# EAGLE design BlindsControl (EAGLE 7.5.0)
Blinds Control
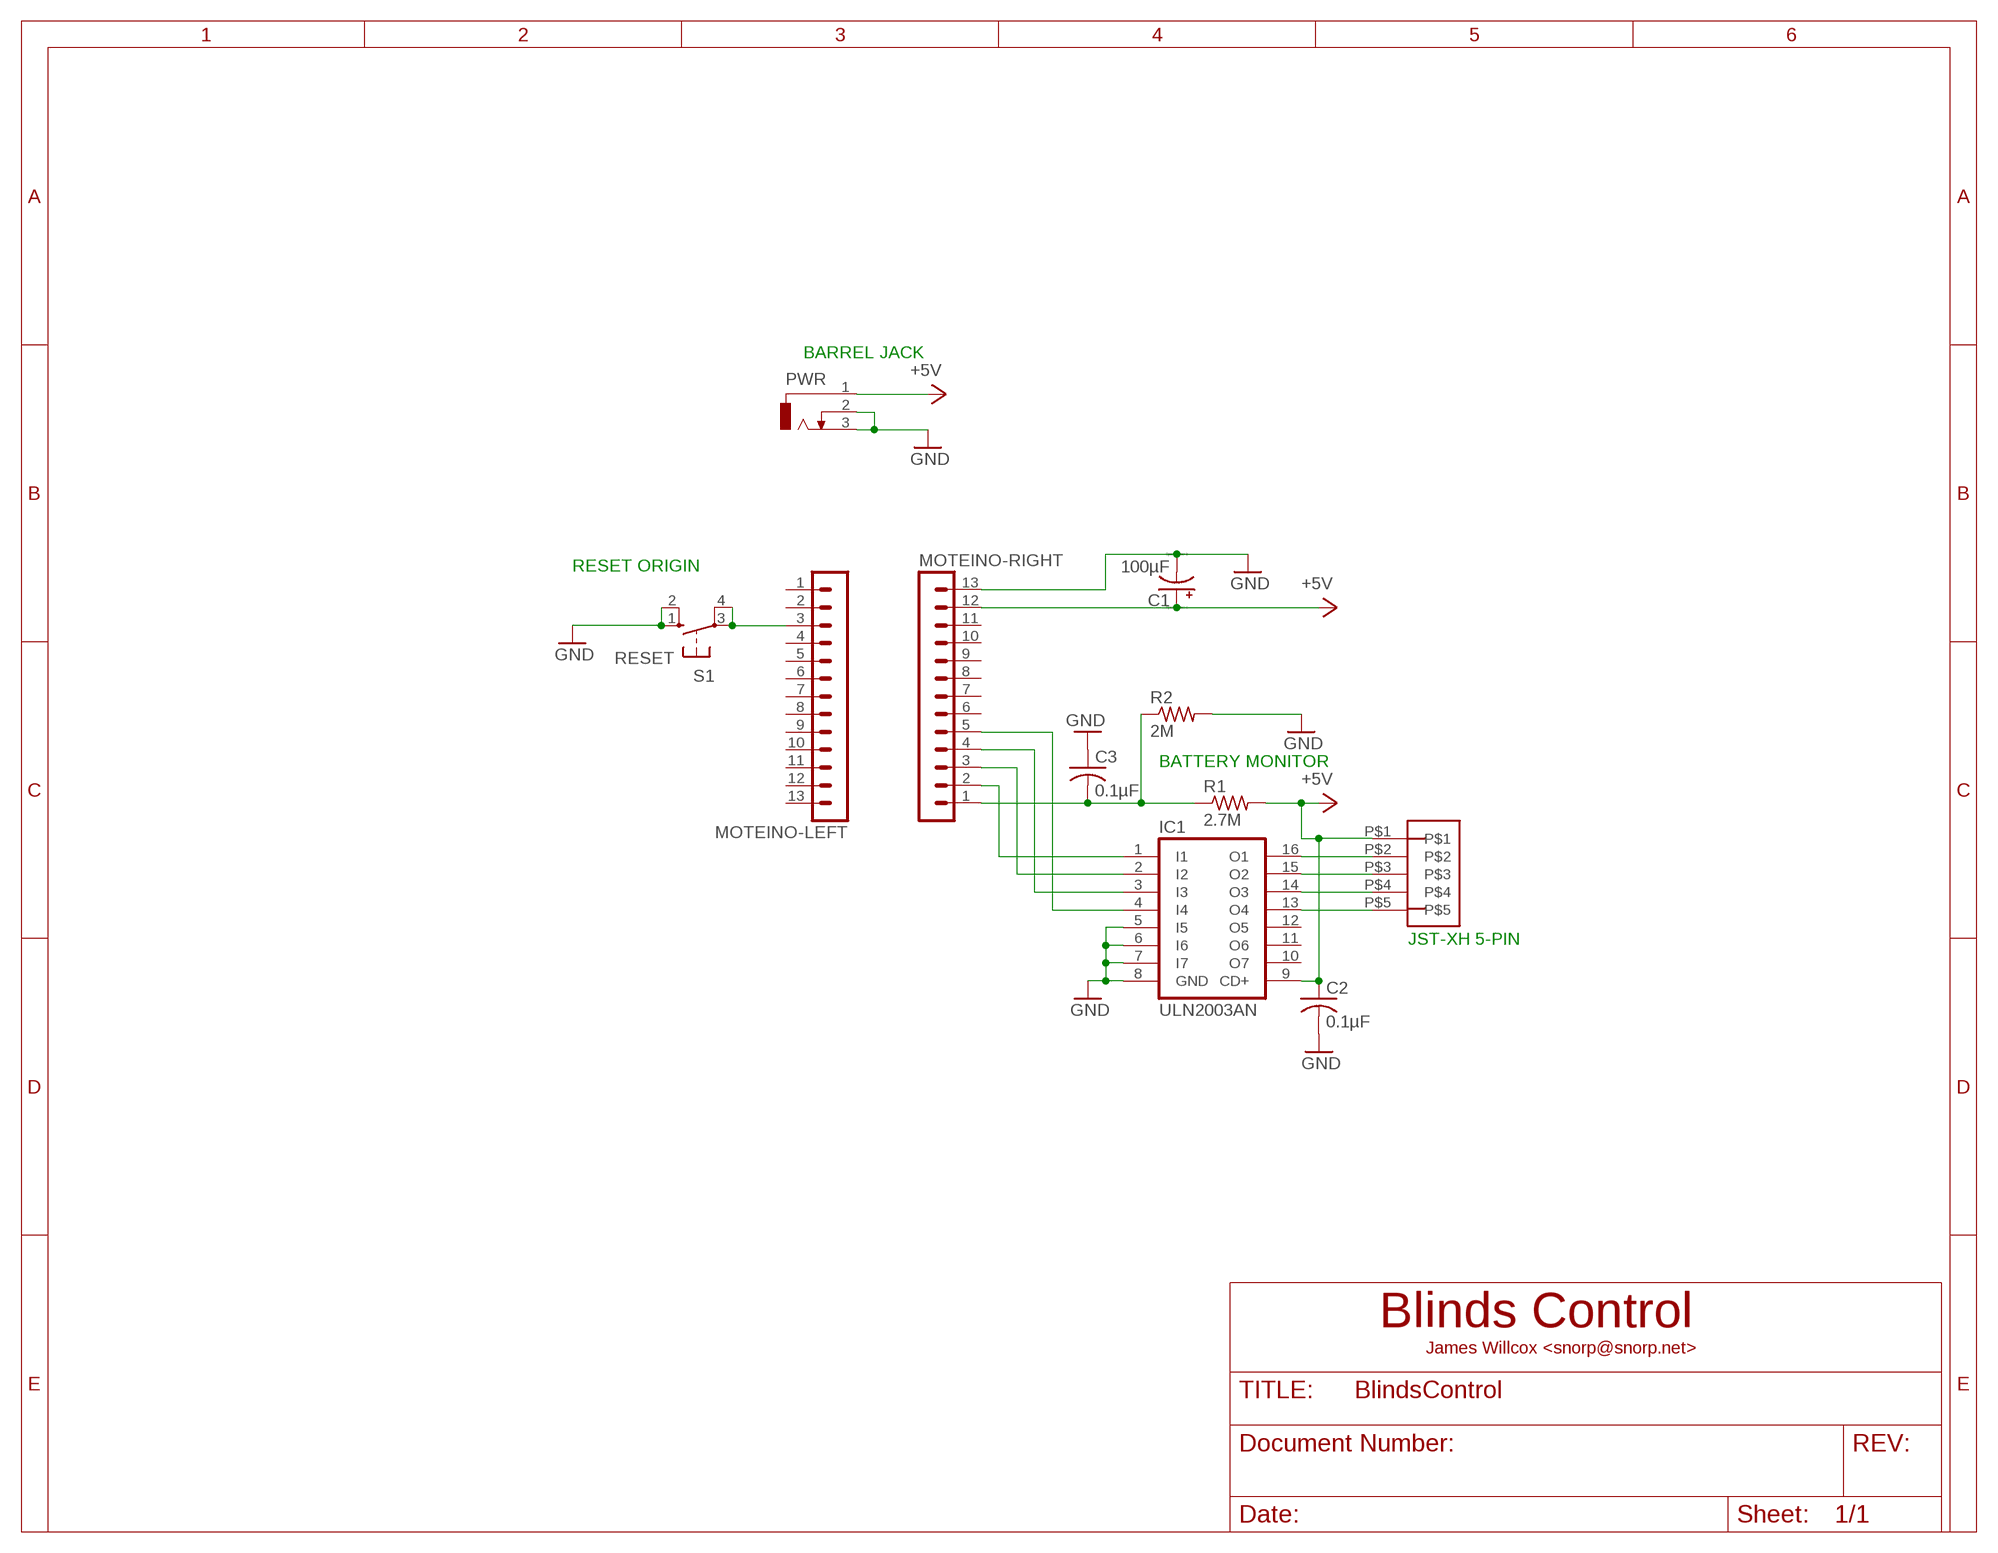
[diagram p0: schematic, sheet 1]

## Parts
C1  100µF  CPOL-USTAP5-60  [TAP5-60]
C2  0.1µF  C-US025-025X050  [C025-025X050]
C3  0.1µF  C-US025-025X050  [C025-025X050]
IC1  ULN2003AN  [DIL16]
MOTEINO-LEFT  MA13-1  [MA13-1]
MOTEINO-RIGHT  MA13-1  [MA13-1]
PWR  DCJ0303  [DCJ0303]
R1  2.7M  R-US_0207/7  [0207/7]
R2  2M  R-US_0207/7  [0207/7]
S1  RESET  10-XX  [B3F-10XX]
U$1  5_PIN_JST-XH  [5_PIN_JST-XH]

## Nets
+5V: C1.+ C2.1 IC1.9(CD+) MOTEINO-RIGHT.12 PWR.1 R1.2 U$1.P$1
GND: C1.- C2.2 C3.1 IC1.5(I5) IC1.6(I6) IC1.7(I7) IC1.8(GND) MOTEINO-RIGHT.13 PWR.2 PWR.3 R2.2 S1.1(S) S1.2(S1)
N$1: C3.2 MOTEINO-RIGHT.1 R1.1 R2.1
N$2: IC1.1(I1) MOTEINO-RIGHT.2
N$5: IC1.2(I2) MOTEINO-RIGHT.3
N$6: MOTEINO-LEFT.3 S1.3(P) S1.4(P1)
N$7: IC1.3(I3) MOTEINO-RIGHT.4
N$8: IC1.4(I4) MOTEINO-RIGHT.5
N$9: IC1.16(O1) U$1.P$2
N$10: IC1.15(O2) U$1.P$3
N$11: IC1.14(O3) U$1.P$4
N$12: IC1.13(O4) U$1.P$5
Unconnected: IC1.10(O7) IC1.11(O6) IC1.12(O5) MOTEINO-LEFT.1 MOTEINO-LEFT.2 MOTEINO-LEFT.4 MOTEINO-LEFT.5 MOTEINO-LEFT.6 MOTEINO-LEFT.7 MOTEINO-LEFT.8 MOTEINO-LEFT.9 MOTEINO-LEFT.10 MOTEINO-LEFT.11 MOTEINO-LEFT.12 MOTEINO-LEFT.13 MOTEINO-RIGHT.6 MOTEINO-RIGHT.7 MOTEINO-RIGHT.8 MOTEINO-RIGHT.9 MOTEINO-RIGHT.10 MOTEINO-RIGHT.11

## Notes on the sheet
- BARREL JACK
- RESET ORIGIN
- BATTERY MONITOR
- JST-XH 5-PIN
- Blinds Control
- James Willcox <snorp@snorp.net>

## Library data of the parts
C1 = resistor:CPOL-US: POLARIZED CAPACITOR, American symbol
C2 C3 = resistor:C-US: CAPACITOR, American symbol
IC1 = uln-udn:ULN2003A: DRIVER ARRAY
MOTEINO-LEFT MOTEINO-RIGHT = con-lstb:MA13-1: PIN HEADER; OC_FARNELL: unknown; OC_NEWARK: unknown
PWR = con-jack:DCJ0303: DC POWER JACK Source: DCJ0303.pdf; OC_FARNELL: unknown; OC_NEWARK: unknown
R1 R2 = resistor:R-US_: RESISTOR, American symbol
S1 = switch-omron:10-XX: OMRON SWITCH; MPN: B3F-1000; OC_FARNELL: 176432; OC_NEWARK: 36M3542
U$1 = JST-XH_HEADERS:5_PIN_JST-XH

## Board
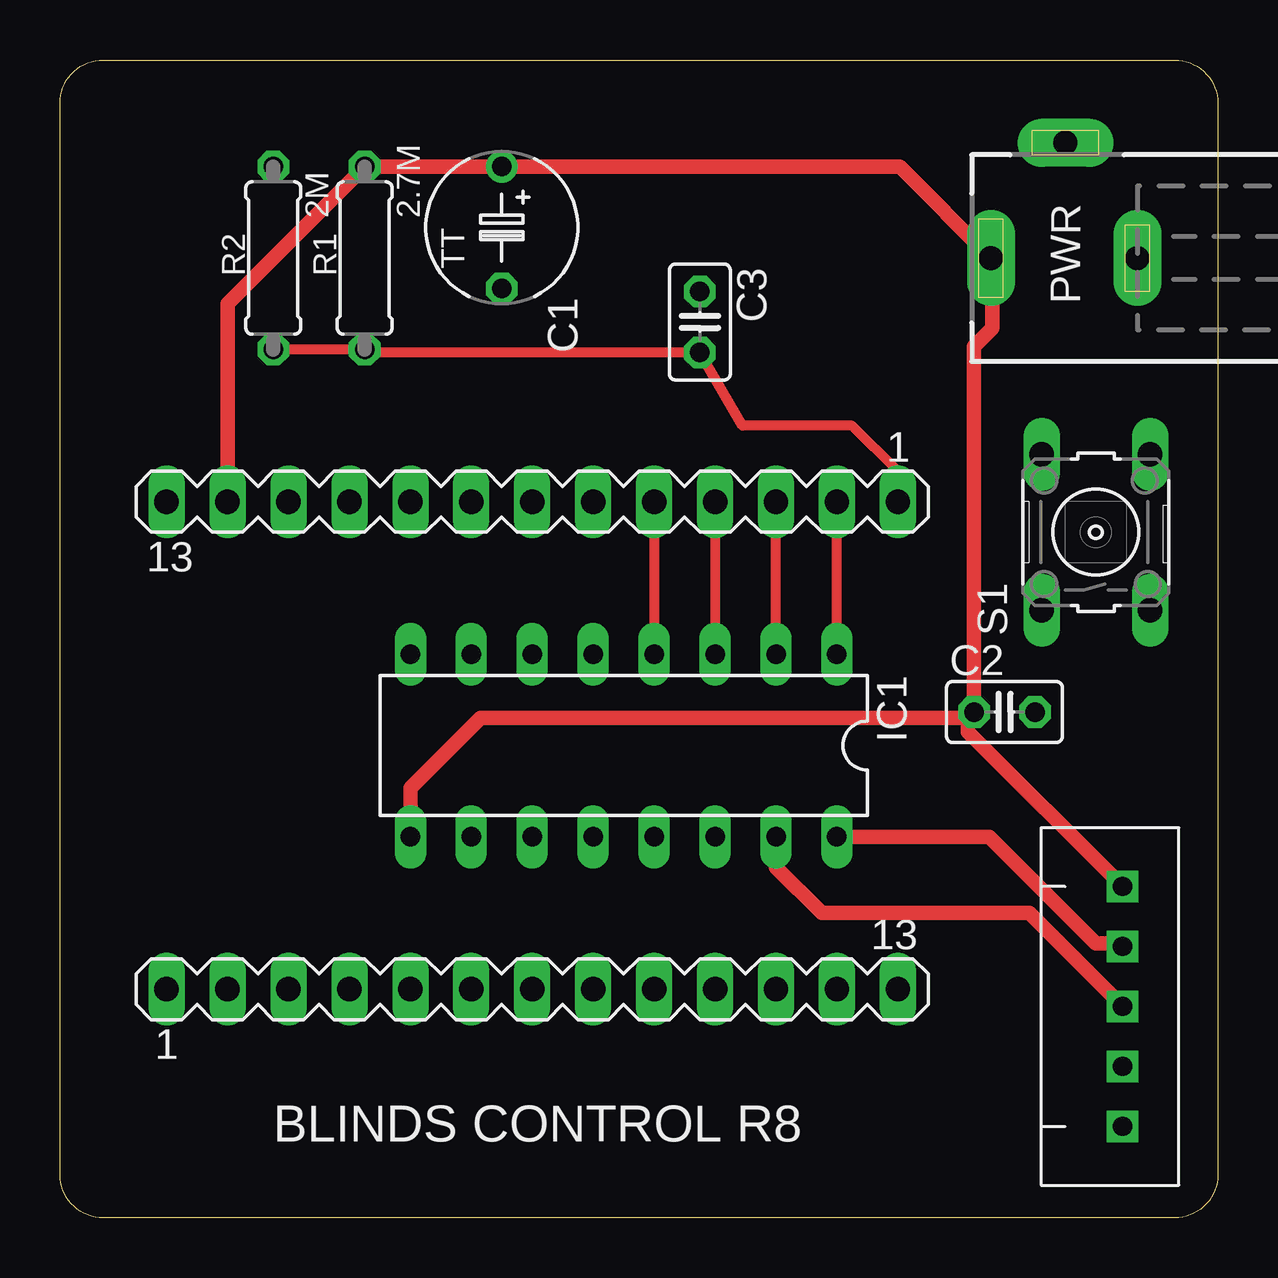
[diagram p1: board, top side]
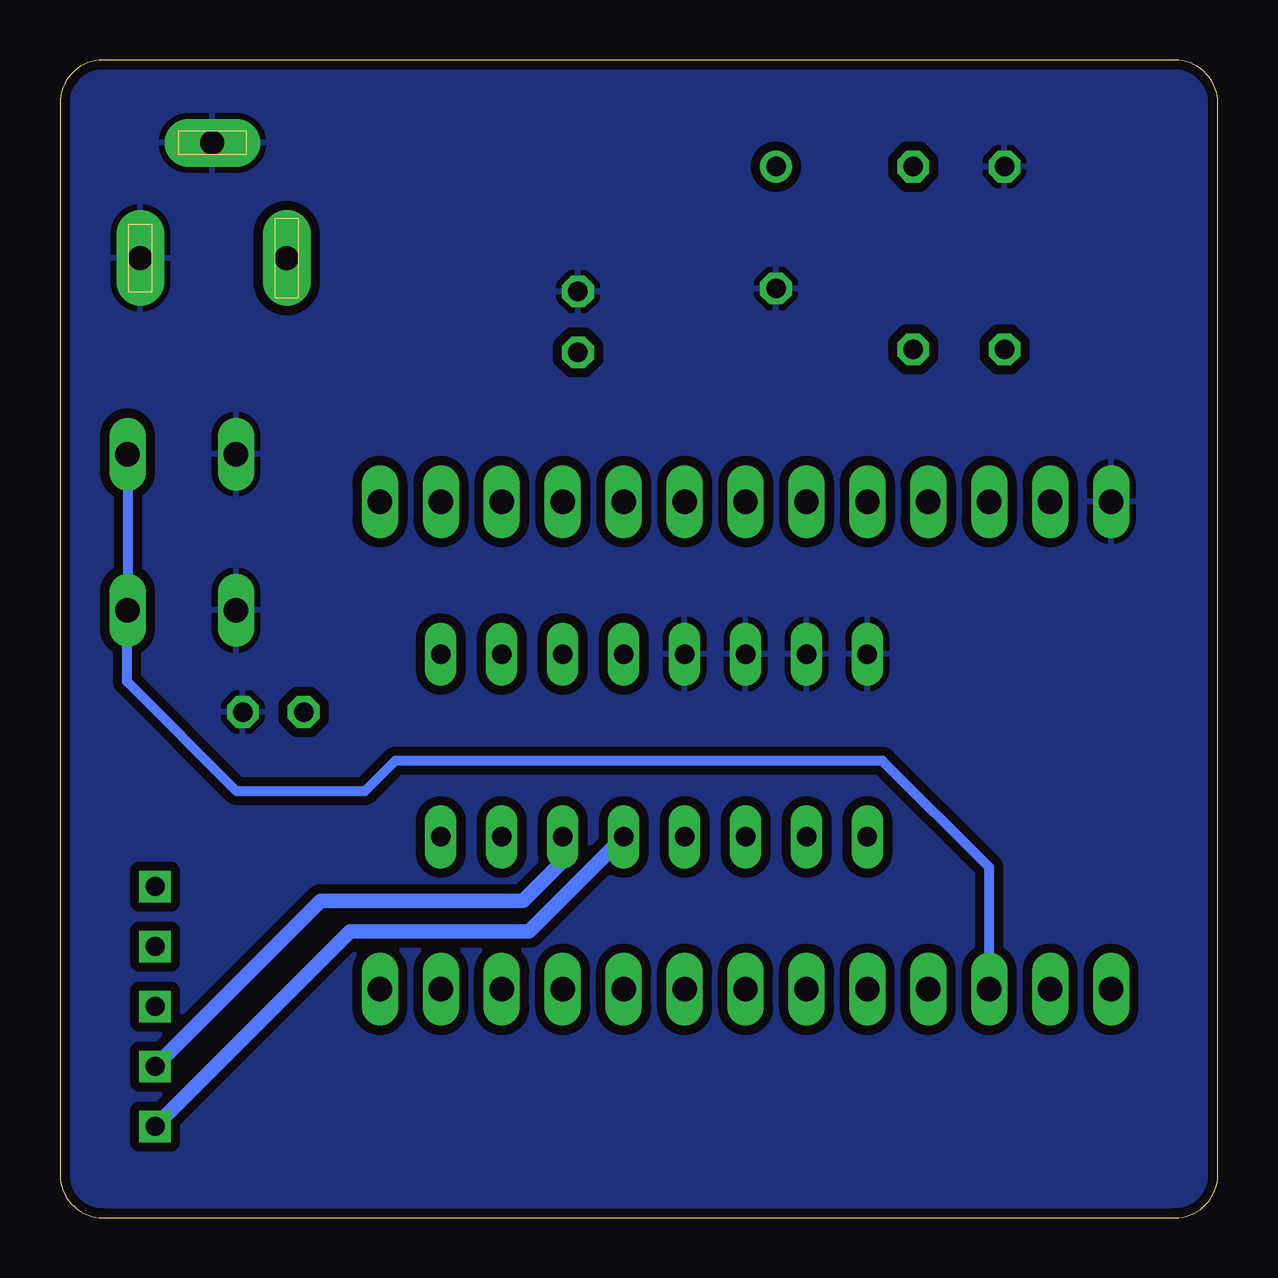
[diagram p2: board, bottom side, seen from below]

Size 48.26 x 48.26 mm. Coordinates in mm from the lower left corner, seen from the top.
Outline: 0,1.8 0,46.46 arc-90 1.8,48.26 46.46,48.26 arc-90 48.26,46.46 48.26,1.8 arc-90 46.46,0 1.8,0 arc-90 0,1.8
Copper layers (1*16): Top 0.035mm / dielectric 1.5mm / Bottom 0.035mm
Design rules "SeeedStudio_2layer_DRU_no_angle_20140221": minimum track width 6mil, minimum drill 12mil, track to track 6mil, track to pad 6mil, pad to pad 6mil, via to via 6mil, smd to smd 0mil, copper to edge 10mil, drill to drill 10mil, minimum pad ring 10mil, minimum via ring 6mil, stop-mask expansion 2mil, vias tented up to drill 100mil, thermal gap 10mil

### Footprints (pad centres in the part's own frame; a part is rotated, then mirrored left to right if it is on the bottom)
TAP5-60 = drill 0.813: + -2.54,0 | drill 0.813 octagon: - 2.54,0
C025-025X050 = drill 0.813 octagon: 1 -1.27,0; 2 1.27,0
DIL16 = drill 0.813 long: 1 -8.89,-3.81; 2 -6.35,-3.81; 3 -3.81,-3.81; 4 -1.27,-3.81; 5 1.27,-3.81; 6 3.81,-3.81; 7 6.35,-3.81; 8 8.89,-3.81; 9 8.89,3.81; 10 6.35,3.81; 11 3.81,3.81; 12 1.27,3.81; 13 -1.27,3.81; 14 -3.81,3.81; 15 -6.35,3.81; 16 -8.89,3.81
MA13-1 = drill 1.016 long: 1 -15.24,0; 2 -12.7,0; 3 -10.16,0; 4 -7.62,0; 5 -5.08,0; 6 -2.54,0; 7 0,0; 8 2.54,0; 9 5.08,0; 10 7.62,0; 11 10.16,0; 12 12.7,0; 13 15.24,0
DCJ0303 = drill 1 pad 2 long: 1 0,3.1; 2 4.8,0; 3 0,-3
0207/7 = drill 0.813 octagon: 1 -3.81,0; 2 3.81,0
B3F-10XX = drill 1.016 long: 1 -3.251,2.261; 2 3.251,2.261; 3 -3.251,-2.261; 4 3.251,-2.261
5_PIN_JST-XH = drill 0.8 square: P$1 2.45,3.4; P$2 4.95,3.4; P$3 7.45,3.4; P$4 9.95,3.4; P$5 12.45,3.4

### Placement (x,y rotation side)
C1  18.41,41.27 270 top
C2  39.37,21.08 0 top
C3  26.67,37.34 270 top
IC1  23.5,19.68 180 top
MOTEINO-LEFT  19.68,9.53 0 top
MOTEINO-RIGHT  19.68,29.84 180 top
PWR  41.91,40.01 90 top
R1  12.7,40.01 90 top
R2  8.89,40.01 90 top
S1  43.18,28.57 90 top
U$1  40.89,16.26 270 top

### Tracks (layer width: path | path; a pad name or v marks a point on that pad's centre or on a via)
+5V
  Top 0.61: MOTEINO-RIGHT.12 6.99,38.1 R1.2 C1.+ 35,43.81 PWR.1 38.86,39.95 38.86,37.08 38.1,36.32 C2.1 37.85,20.83 | IC1.9 14.61,17.91 17.53,20.83 37.85,20.83 | 37.85,20.83 37.85,20.25 U$1.P$1
GND
  pour Bottom (isolate 0.381): 0,0 0,48.26 48.26,48.26 48.26,0
N$1
  Top 0.406: R2.1 R1.1 12.83,36.07 C3.2 28.45,33.02 33.02,33.02 34.92,31.11 MOTEINO-RIGHT.1
N$2
  Top 0.406: IC1.1 MOTEINO-RIGHT.2
N$5
  Top 0.406: IC1.2 MOTEINO-RIGHT.3
N$6
  Bottom 0.406: S1.4 S1.3 | MOTEINO-LEFT.3 9.53,14.61 13.97,19.05 34.29,19.05 35.56,17.78 40.89,17.78 45.47,22.35 45.47,25.3
  Bottom 0.61: 45.47,25.3 S1.3
N$7
  Top 0.406: MOTEINO-RIGHT.4 IC1.3
N$8
  Top 0.406: MOTEINO-RIGHT.5 IC1.4
N$9
  Top 0.61: IC1.16 38.73,15.88 43.18,11.43 44.17,11.43 U$1.P$2
N$10
  Top 0.61: IC1.15 29.84,14.61 31.75,12.7 40.4,12.7 U$1.P$3
N$11
  Bottom 0.61: IC1.14 27.3,14.86 28.96,13.21 37.39,13.21 U$1.P$4
N$12
  Bottom 0.61: IC1.13 28.7,11.94 36.16,11.94 U$1.P$5

### Text on the board
tNames: BLINDS CONTROL R8